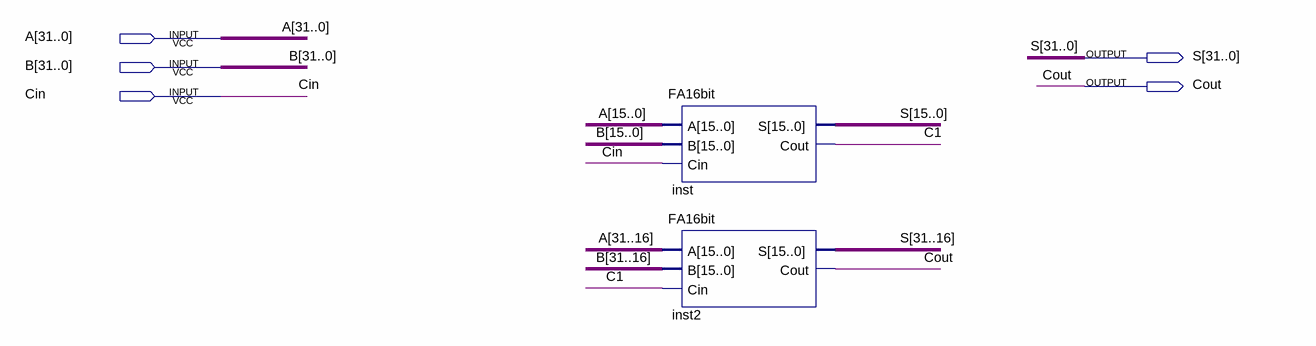
[diagram p0: schematic sheet]
// Quartus schematic FA32BIT.bdf as structural Verilog: 2 symbols, 5 pins
module FA32BIT (
  input  [31:0] A,
  input  [31:0] B,
  input  Cin,
  output [31:0] S,
  output Cout
);

  wire C1;

  FA16bit inst (.A(A[15:0]), .B(B[15:0]), .Cin(Cin), .S(S[15:0]), .Cout(C1));
  FA16bit inst2 (.A(A[31:16]), .B(B[31:16]), .Cin(C1), .S(S[31:16]), .Cout(Cout));
endmodule
